# EasyEDA Pro project FC_GC_PCB.eprj

# Schematic Schematic6
Create Date: 2024-12-30; Page Name: P1; Project Name: Quadrotor_Mk2; Schematic Name: Schematic6; Update Date: 2025-01-03; Company: EasyEDA.com; Drawn: EasyEDA; Page Size: A4; Part Number: JLCPCB-002; Reviewed: EasyEDA; Version: V0.1
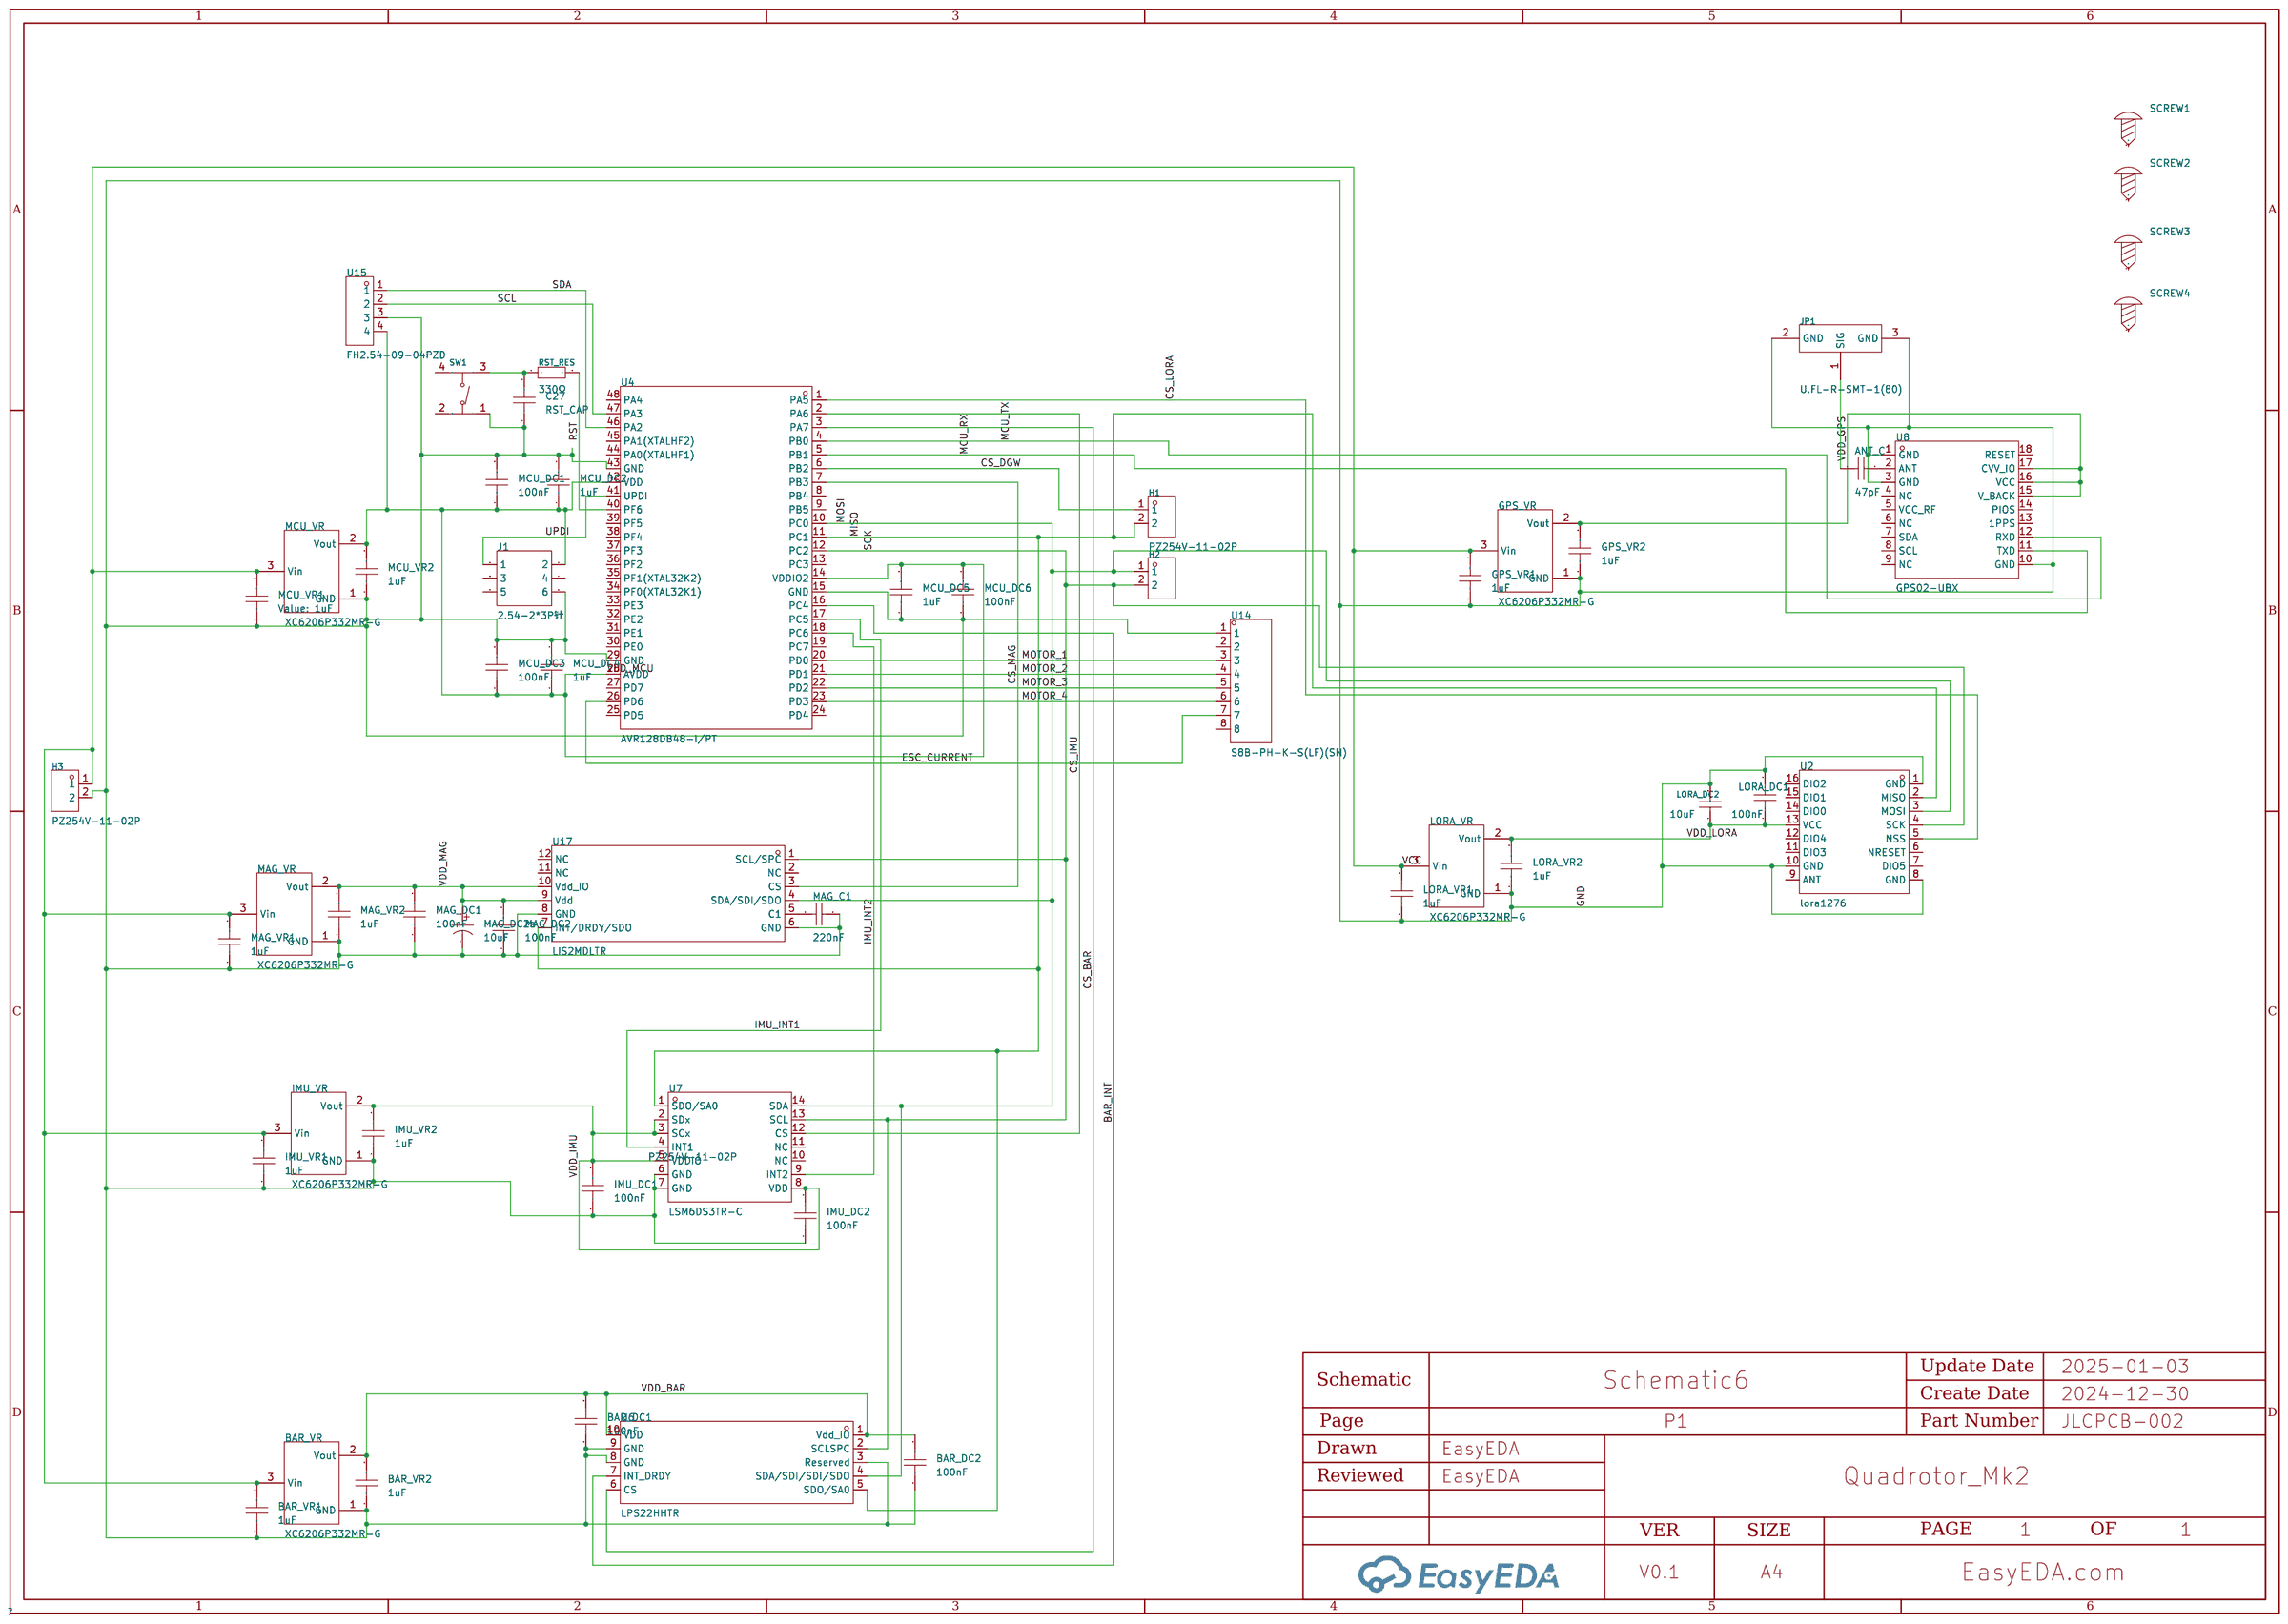
[diagram p0: schematic sheet]

## Parts
ANT_C  47pF  [C0402]
BAR_DC1  100nF  [C0402]
BAR_DC2  100nF  [C0402]
BAR_VR  XC6206P332MR-G  [SOT-23-3_L2.9-W1.6-P1.90-LS2.8-BR]
BAR_VR1  1uF  [C0402]
BAR_VR2  1uF  [C0402]
C27  1uF  [C0603]
GPS_VR  XC6206P332MR-G  [SOT-23-3_L2.9-W1.6-P1.90-LS2.8-BR]
GPS_VR1  1uF  [C0402]
GPS_VR2  1uF  [C0402]
H1  PZ254V-11-02P  [HDR-TH_2P-P2.54-V-M]
H2  PZ254V-11-02P  [HDR-TH_2P-P2.54-V-M]
H3  PZ254V-11-02P  [HDR-TH_2P-P2.54-V-M]
IMU_DC1  100nF  [C0402]
IMU_DC2  100nF  [C0402]
IMU_VR  XC6206P332MR-G  [SOT-23-3_L2.9-W1.6-P1.90-LS2.8-BR]
IMU_VR1  1uF  [C0402]
IMU_VR2  1uF  [C0402]
J1  2.54-2*3P针  [HDR-TH_6P-P2.54-V-M-R2-C3-S2.54-1]
JP1  U.FL-R-SMT-1(80)  [RF-SMD_FRF05002-JSS103M]
LORA_DC1  100nF  [C0402]
LORA_DC2  10uF  [C0402]
LORA_VR  XC6206P332MR-G  [SOT-23-3_L2.9-W1.6-P1.90-LS2.8-BR]
LORA_VR1  1uF  [C0402]
LORA_VR2  1uF  [C0402]
MAG_C1  220nF  [C0402]
MAG_DC1  100nF  [C0402]
MAG_DC2  100nF  [C0402]
MAG_DC2a  10uF  [CAP-SMD_BD6.3-L6.6-W6.6-FD]
MAG_VR  XC6206P332MR-G  [SOT-23-3_L2.9-W1.6-P1.90-LS2.8-BR]
MAG_VR1  1uF  [C0402]
MAG_VR2  1uF  [C0402]
MCU_DC1  100nF  [C0402]
MCU_DC2  1uF  [C0402]
MCU_DC3  100nF  [C0402]
MCU_DC4  1uF  [C0402]
MCU_DC5  1uF  [C0402]
MCU_DC6  100nF  [C0402]
MCU_VR  XC6206P332MR-G  [SOT-23-3_L2.9-W1.6-P1.90-LS2.8-BR]
MCU_VR1  1uF  [C0402]
MCU_VR2  1uF  [C0402]
RST_RES  330Ω  [R0402]
SCREW1  -  [Screw-Hole-M2]
SCREW2  -  [Screw-Hole-M2]
SCREW3  -  [Screw-Hole-M2]
SCREW4  -  [Screw-Hole-M2]
SW1  TS-1187A-B-A-B  [SW-SMD_4P-L5.1-W5.1-P3.70-LS6.5-TL-2]
U2  lora1276  [COMM-SMD_LORA1276-C1-915MHZ]
U4  AVR128DB48-I/PT  [TQFP-48_L7.0-W7.0-P0.50-LS9.0-BL]
U6  LPS22HHTR  [HLGA-10L_LPS22HBTR]
U7  LSM6DS3TR-C  [LGA-14_L3.0-W2.5-P0.50-TL]
U8  GPS02-UBX  [WIRELM-SMD_18P-L16.5-W14.5_P1.80-TL]
U14  S8B-PH-K-S(LF)(SN)  [CONN-TH_S8B-PH-K-S-LF-SN]
U15  FH2.54-09-04PZD  [HDR-TH_4P-P2.54-V-F]
U17  LIS2MDLTR  [LGA-12_L2.0-W2.0-P0.50-BL]

## Library data of the parts
ANT_C = 0402CG470J500NT: Capacitance: Tolerance:±5% Tolerance:±5% Voltage Rated: Temperature Coefficient:; LCSC Part Name: 47pF ±5% 50V; Supplier Part: C1567; Manufacturer: FH(风华); Supplier Footprint: 0402; JLCPCB Part Class: Basic Part; Datasheet: https://atta.szlcsc.com/upload/public/pdf/source/20200305/C486355_26A10D38EF8C2A5C37091D0039909270.pdf; Supplier: LCSC; Tolerance: ±5%
BAR_DC1 BAR_DC2 IMU_DC1 IMU_DC2 LORA_DC1 MAG_DC1 MAG_DC2 MCU_DC1 MCU_DC3 MCU_DC6 = CL05B104KO5NNNC: Capacitance: Tolerance:±10% Tolerance:±10% Voltage Rated: Temperature Coefficient:; LCSC Part Name: 100nF ±10% 16V; Supplier Part: C1525; Manufacturer: SAMSUNG(三星); Supplier Footprint: 0402; JLCPCB Part Class: Basic Part; Datasheet: https://atta.szlcsc.com/upload/public/pdf/source/20160218/1457707763339.pdf; Supplier: LCSC; Tolerance: ±10%
BAR_VR GPS_VR IMU_VR LORA_VR MAG_VR MCU_VR = XC6206P332MR-G_C5446: Output Type: Maximum Input Voltage:6V Output Voltage:3.3V Output Voltage:3.3V MAX Output Current:200mA Power Supply Rejection Ratio (PSRR):- Dropout Voltage:680mV@(100mA) Output Polarity:Positive electrode Number of Outputs:1; LCSC Part Name: 输入6V 输出3.3V 200mA; Supplier Part: C5446; Manufacturer: TOREX(特瑞仕); Supplier Footprint: SOT-23-3L; JLCPCB Part Class: Basic Part; Datasheet: https://atta.szlcsc.com/upload/public/pdf/source/20130823/1457706639850.pdf; Supplier: LCSC; Maximum Input Voltage: 6V; Output Voltage: 3.3V; MAX Output Current: 200mA; Dropout Voltage: 680mV@(100mA); Output Polarity: Positive electrode; Number of Outputs: 1
BAR_VR1 BAR_VR2 GPS_VR1 GPS_VR2 IMU_VR1 IMU_VR2 LORA_VR1 LORA_VR2 MAG_VR1 MAG_VR2 MCU_DC2 MCU_DC4 MCU_DC5 MCU_VR1 MCU_VR2 = CL05A105KA5NQNC: Capacitance: Tolerance:±10% Tolerance:±10% Voltage Rated: Temperature Coefficient:; LCSC Part Name: 1uF ±10% 25V; Supplier Part: C52923; Manufacturer: SAMSUNG(三星); Supplier Footprint: 0402; JLCPCB Part Class: Basic Part; Datasheet: https://atta.szlcsc.com/upload/public/pdf/source/20160218/1457707763339.pdf; Supplier: LCSC; Tolerance: ±10%
C27 = CL10A105KB8NNNC: Capacitance: Tolerance:±10% Tolerance:±10% Voltage Rated: Temperature Coefficient:; LCSC Part Name: 1uF ±10% 50V; Supplier Part: C15849; Manufacturer: SAMSUNG(三星); Supplier Footprint: 0603; JLCPCB Part Class: Basic Part; Datasheet: https://atta.szlcsc.com/upload/public/pdf/source/20160218/1457707763339.pdf; Supplier: LCSC; Tolerance: ±10%
H1-H3 = PZ254V-11-02P: Pin Structure:1x2P Pitch:2.54mm Row Spacing:- Circluar Pins/Square Pins:Square Pins Mounting Type:Straight Number of Rows:Plugin Number of Pins:2P Current Rating (Max):- Voltage Rating (Max):- Length of Mating Pin:6mm Insulation Height:2.5mm Length of End; LCSC Part Name: 间距:2.54mm 1x2P 直插 方针; Supplier Part: C492401; Manufacturer: XFCN(兴飞); Supplier Footprint: 插件,P=2.54mm; JLCPCB Part Class: Extended Part; Datasheet: https://atta.szlcsc.com/upload/public/pdf/source/20200309/C492401_A812433581A9B211A7FFA413ADDFF0E5.pdf; Supplier: LCSC; Pin Structure: 1x2P; Pitch: 2.54mm; Circluar Pins/Square Pins: Square Pins; Mounting Type: Straight; Number of Rows: Plugin; Number of Pins: 2P; Length of Mating Pin: 6mm; Insulation Height: 2.5mm; Length of End Connection Pin: 3mm; Operating Temperature Range: -40℃~+105℃; Color: Black
J1 = 2.54-2*3P针: Pin Structure:- Pitch:2.54mm Row Spacing:- Circluar Pins/Square Pins:- Mounting Type:Straight Number of Rows:双排 Number of Pins:6P Current Rating (Max):- Voltage Rating (Max):- Length of Mating Pin:- Insulation Height:- Contact Material: Contact Plating:-; LCSC Part Name: 间距:2.54mm 直插; Supplier Part: C65114; Manufacturer: BOOMELE(博穆精密); Supplier Footprint: 插件,P=2.54mm; JLCPCB Part Class: Extended Part; Supplier: LCSC; Pitch: 2.54mm; Mounting Type: Straight; Number of Rows: 双排; Number of Pins: 6P; Color: Black
JP1 = U.FL-R-SMT-1(80)_C88374: Connector Type:板端 Interface Type:内针 Number of Ports:1 Interface Diameter:2mm Interface Length/Height:1.25mm Frequency-Max:6GHz RF Series:IPEX Impedance:50Ω Style:- Contact Material:Brass Operating Temperature Range:-40℃~+90℃ Operating Temperature Range:-4; LCSC Part Name: IPEX 内针; Supplier Part: C88374; Manufacturer: HRS(广濑); Supplier Footprint: SMD; JLCPCB Part Class: Extended Part; Datasheet: https://atta.szlcsc.com/upload/public/pdf/source/20161125/1480067868647.pdf; Supplier: LCSC; Connector Type: 板端; Interface Type: 内针; Number of Ports: 1; Interface Diameter: 2mm; Interface Length/Height: 1.25mm; Frequency-Max: 6GHz; RF Series: IPEX; Impedance: 50Ω; Contact Material: Brass; Operating Temperature Range: -40℃~+90℃
LORA_DC2 = CL05A106MQ5NUNC: Capacitance: Tolerance:±20% Tolerance:±20% Voltage Rated: Temperature Coefficient:; LCSC Part Name: 10uF ±20% 6.3V; Supplier Part: C15525; Manufacturer: SAMSUNG(三星); Supplier Footprint: 0402; JLCPCB Part Class: Basic Part; Datasheet: https://atta.szlcsc.com/upload/public/pdf/source/20220823/2B02EE04F8F211D38A52DCB16EB6BEBA.pdf; Supplier: LCSC; Tolerance: ±20%
MAG_C1 = CL05B224KO5NNNC: Capacitance: Tolerance:±10% Tolerance:±10% Voltage Rated: Temperature Coefficient:; LCSC Part Name: 220nF ±10% 16V; Supplier Part: C16772; Manufacturer: SAMSUNG(三星); Supplier Footprint: 0402; JLCPCB Part Class: Basic Part; Datasheet: https://atta.szlcsc.com/upload/public/pdf/source/20160218/1457707763339.pdf; Supplier: LCSC; Tolerance: ±10%
MAG_DC2a = RVT1J100M0605_C72489: Capacitance: Tolerance:±20% Tolerance:±20% Rated Voltage: Ripple Current:15mA@120Hz Equivalent Series Resistance(ESR):- φD: L: Lifetime @ Temp:2000hrs@105℃ Operating Temperature:-40℃~+105℃ Operating Temperature:-40℃~+105℃; LCSC Part Name: 10uF ±20% 63V; Supplier Part: C72489; Manufacturer: ROQANG(容强); Manufacturer Part: RVT1J100M0605; Supplier Footprint: SMD,D6.3xL5.4mm; JLCPCB Part Class: Extended Part; Datasheet: https://atta.szlcsc.com/upload/public/pdf/source/20170325/1490427950282.pdf; Supplier: LCSC; Tolerance: ±20%; Ripple Current: 15mA@120Hz; Lifetime @ Temp: 2000hrs@105℃; Operating Temperature: -40℃~+105℃
RST_RES = 0402WGF3300TCE: Type:Thick Film Resistors Resistance: Tolerance:±1% Tolerance:±1% Power(Watts): Overload Voltage (Max): Temperature Coefficient:±100ppm/℃ Temperature Coefficient:±100ppm/℃ Operating Temperature Range:-55℃~+155℃ Operating Temperature Range:-55℃~+155℃; LCSC Part Name: 330Ω ±1% 62.5mW 厚膜电阻; Supplier Part: C25104; Manufacturer: UNI-ROYAL(厚声); Supplier Footprint: 0402; JLCPCB Part Class: Basic Part; Datasheet: https://atta.szlcsc.com/upload/public/pdf/source/20200306/C422600_1E6D84923E4A46A82E41ADD87F860B5C.pdf; Supplier: LCSC; Type: Thick Film Resistors; Tolerance: ±1%; Temperature Coefficient: ±100ppm/℃; Operating Temperature Range: -55℃~+155℃
SCREW1-SCREW4 = Screw-Hole-M2: Supplier Footprint: 插件
SW1 = TS-1187A-B-A-B: Circuit:SPST Actuator Style:Round Button Operating Force:160gf Mounting Style:Brick nogging Switch Length:5.1mm Switch Width:5.1mm Switch Height:1.5mm Strike Gundam:不带 Contact Current:50mA Voltage Rating (DC):12V Insulation Resistance:- Actuator/Cap Color; LCSC Part Name: 5.1*5.1*1.5mm 立贴 轻触开关; Supplier Part: C318884; Manufacturer: XKB Connectivity(中国星坤); Supplier Footprint: SMD; JLCPCB Part Class: Basic Part; Datasheet: https://atta.szlcsc.com/upload/public/pdf/source/20200227/C318890_053E50208A88A7BA1965D8746000774E.pdf; Supplier: LCSC; Circuit: SPST; Actuator Style: Round Button; Operating Force: 160gf; Mounting Style: Brick nogging; Switch Length: 5.1mm; Switch Width: 5.1mm; Switch Height: 1.5mm; Strike Gundam: 不带; Contact Current: 50mA; Voltage Rating (DC): 12V; Actuator/Cap Color: 金色; With Lamp: No; Mechanical Life: 10万次; Operating Temperature: -30℃~+85℃
U2 = lora1276-C1-915MHz: Frequency:915MHz; LCSC Part Name: 915MHz无线模块; Supplier Part: C3001531; Manufacturer: G-NiceRF(思为无线); Supplier Footprint: SMD,16x16mm; JLCPCB Part Class: Extended Part; Datasheet: https://atta.szlcsc.com/upload/public/pdf/source/20220425/530C73F5612432B98CDC262676D34B0B.pdf; Supplier: LCSC
U4 = AVR128DB48-I/PT: CPU Core:AVR Program Storage Size:128KB GPIO Ports Number:41 Operating Voltage Range:1.8V~5.5V Operating Voltage Range:1.8V~5.5V CPU Maximum Speed:24MHz Program Memory Type:FLASH Operating Temperature Range:-40℃~+85℃ Operating Temperature Range:-40℃~+85℃; Supplier Part: C1019766; Manufacturer: MICROCHIP(美国微芯); Supplier Footprint: TQFP-48(7x7); JLCPCB Part Class: Extended Part; Datasheet: https://atta.szlcsc.com/upload/public/pdf/source/20220119/C1518646_E8BAF3779FDA96BF0868C8C588FF4BEB.pdf; Supplier: LCSC; CPU Core: AVR; Program Storage Size: 128KB; GPIO Ports Number: 41; Operating Voltage Range: 1.8V~5.5V; CPU Maximum Speed: 24MHz; Program Memory Type: FLASH; Operating Temperature Range: -40℃~+85℃; ADC (Bit): 12bit; DAC (Bit): 10bit; Peripheral/Function: WDT；PWM; Watchdog: 有; Low-Voltage Detect: 有; Internal Oscillator: 有
U6 = LPS22HHTR: Pressure range:26Kpa~126Kpa Pressure range:26Kpa~126Kpa The Power Supply Voltage:1.7V~3.6V The Power Supply Voltage:1.7V~3.6V Operating Temperature:-40℃~+85℃ Operating Temperature:-40℃~+85℃; Supplier Part: C2827824; Manufacturer: ST(意法半导体); Supplier Footprint: HLGA-10(2x2); JLCPCB Part Class: Extended Part; Datasheet: https://atta.szlcsc.com/upload/public/pdf/source/20210707/C2827824_E4CD2E1AEEC461DC537A3A43C6466376.pdf; Supplier: LCSC; Pressure range: 26Kpa~126Kpa; The Power Supply Voltage: 1.7V~3.6V; Operating Temperature: -40℃~+85℃
U7 = LSM6DS3TR-C: Sensor Type:Accelerometer gyroscope Operating Temperature:-40℃~+85℃ Operating Temperature:-40℃~+85℃; LCSC Part Name: IMU-惯性测量单元; Supplier Part: C967633; Manufacturer: ST(意法半导体); Supplier Footprint: LGA-14(2.5x3); JLCPCB Part Class: Extended Part; Datasheet: https://atta.szlcsc.com/upload/public/pdf/source/20210226/C967633_4D8B3A108D63359423D57B97CE5134B1.pdf; Supplier: LCSC; Sensor Type: Accelerometer gyroscope; Operating Temperature: -40℃~+85℃
U8 = GPS02-UBX: LCSC Part Name: 全球导航卫星系统GNSS定位模块; Supplier Part: C5356636; Manufacturer: G-NiceRF(思为无线); Supplier Footprint: SMD,14.5x16.5mm; JLCPCB Part Class: Extended Part; Datasheet: https://atta.szlcsc.com/upload/public/pdf/source/20240219/98FC715792FCB9DB389B319052DA0820.pdf; Supplier: LCSC
U14 = S8B-PH-K-S(LF)(SN): Pins Structure:1x8P Pitch:2mm Mounting Style:Bend insert Reference Series:PH Number of Pins:8P Number of Rows:1 Number of PINs Per Row:8 Row Spacing:- Current Rating (Max):2A Contact Material:Brass Contact Plating:Tin Operating Temperature Range:-25℃~+85℃; LCSC Part Name: 1x8P 间距:2mm 弯插 系列:PH; Supplier Part: C157915; Manufacturer: JST; Supplier Footprint: 弯插,P=2mm; JLCPCB Part Class: Extended Part; Datasheet: https://atta.szlcsc.com/upload/public/pdf/source/20181010/C265101_22107ACC4D8714694FDA2DD97145FA81.pdf; Supplier: LCSC; Pins Structure: 1x8P; Pitch: 2mm; Mounting Style: Bend insert; Reference Series: PH; Number of Pins: 8P; Number of Rows: 1; Number of PINs Per Row: 8; Current Rating (Max): 2A; Contact Material: Brass; Contact Plating: Tin; Operating Temperature Range: -25℃~+85℃; Rated Voltage (Max): 100V; Plastic Material: PA66; Flame Retardant Rating: UL94V-0; Supplementary Features: K-leg punch; Colour: White; Z-Height of the Board: 4.8mm; X-Length of Bottom Edge on Board (Spacing Line): 17.9mm; Y-Width of Bottom Edge on Board: 7.6mm
U15 = FH2.54-09-04PZD: Supplier Part: C7500773; Manufacturer: XUNPU(讯普); Supplier Footprint: 插件,P=2.54mm; JLCPCB Part Class: Extended Part; Datasheet: https://atta.szlcsc.com/upload/public/pdf/source/20230809/12C46BEDB70740F4680EB1129D481D12.pdf; Supplier: LCSC
U17 = LIS2MDLTR: LCSC Part Name: 霍尔效应开关; Supplier Part: C919695; Manufacturer: ST(意法半导体); Supplier Footprint: LGA-12(2x2); JLCPCB Part Class: Extended Part; Datasheet: https://atta.szlcsc.com/upload/public/pdf/source/20211119/145E3A73C2A09E2C981D93C27CF540FA.pdf; Supplier: LCSC

## Nets
GND: BAR_DC1.1 BAR_DC2.1 BAR_VR.1(GND) BAR_VR1.1 BAR_VR2.1 C27.1 GPS_VR.1(GND) GPS_VR1.1 GPS_VR2.1 H3.2 IMU_DC1.1 IMU_DC2.1 IMU_VR.1(GND) IMU_VR1.1 IMU_VR2.1 J1.6 JP1.2(GND) JP1.3(GND) LORA_DC1.2 LORA_DC2.2 LORA_VR.1(GND) LORA_VR1.1 LORA_VR2.1 MAG_C1.2 MAG_DC1.1 MAG_DC2.1 MAG_DC2a.2 MAG_VR.1(GND) MAG_VR1.1 MAG_VR2.1 MCU_DC1.2 MCU_DC2.2 MCU_DC3.2 MCU_DC4.2 MCU_DC5.1 MCU_DC6.1 MCU_VR.1(GND) MCU_VR1.1 MCU_VR2.1 SW1.1(A) U2.1(GND) U2.8(GND) U2.10(GND) U4.15(GND) U4.29(GND) U4.43(GND) U6.3(Reserved) U6.8(GND) U6.9(GND) U7.6(GND) U7.7(GND) U8.1(GND) U8.3(GND) U8.10(GND) U14.1 U15.3 U17.6(GND) U17.8(GND)
VCC: BAR_VR.3(Vin) BAR_VR1.2 GPS_VR.3(Vin) GPS_VR1.2 H3.1 IMU_VR.3(Vin) IMU_VR1.2 LORA_VR.3(Vin) LORA_VR1.2 MAG_VR.3(Vin) MAG_VR1.2 MCU_VR.3(Vin) MCU_VR1.2
VDD_BAR: BAR_DC1.2 BAR_DC2.2 BAR_VR.2(Vout) BAR_VR2.2 U6.1(Vdd_IO) U6.10(VDD)
VDD_GPS: GPS_VR.2(Vout) GPS_VR2.2 U8.15(V_BACK) U8.16(VCC) U8.17(CVV_IO)
VDD_IMU: IMU_DC1.2 IMU_DC2.2 IMU_VR.2(Vout) IMU_VR2.2 U7.2(SDx) U7.3(SCx) U7.5(VDDIO) U7.8(VDD)
VDD_LORA: LORA_DC1.1 LORA_DC2.1 LORA_VR.2(Vout) LORA_VR2.2 U2.13(VCC)
VDD_MAG: MAG_DC1.2 MAG_DC2.2 MAG_DC2a.1 MAG_VR.2(Vout) MAG_VR2.2 U17.9(Vdd) U17.10(Vdd_IO)
VDD_MCU: J1.2 MCU_DC1.1 MCU_DC2.1 MCU_DC3.1 MCU_DC4.1 MCU_DC5.2 MCU_DC6.2 MCU_VR.2(Vout) MCU_VR2.2 U4.14(VDDIO2) U4.28(AVDD) U4.42(VDD) U15.4
BAR_INT: U4.16(PC4) U6.7(INT_DRDY)
CS_BAR: U4.3(PA7) U6.6(CS)
CS_DGW: H1.1 U4.6(PB2)
CS_IMU: U4.2(PA6) U7.12(CS)
CS_LORA: U2.5(NSS) U4.1(PA5)
CS_MAG: U4.7(PB3) U17.3(CS)
ESC_CURRENT: U4.26(PD6) U14.7
IMU_INT1: U4.17(PC5) U7.4(INT1)
IMU_INT2: U4.18(PC6) U7.9(INT2)
MCU_RX: U4.5(PB1) U8.11(TXD)
MCU_TX: U4.4(PB0) U8.12(RXD)
MISO: H1.2 U2.2(MISO) U4.11(PC1) U6.5(SDO/SA0) U7.1(SDO/SA0) U17.7(INT/DRDY/SDO)
MOSI: H2.1 U2.3(MOSI) U4.10(PC0) U6.4(SDA/SDI/SDI/SDO) U7.14(SDA) U17.4(SDA/SDI/SDO)
MOTOR_1: U4.20(PD0) U14.3
MOTOR_2: U4.21(PD1) U14.4
MOTOR_3: U4.22(PD2) U14.5
MOTOR_4: U4.23(PD3) U14.6
RST: RST_RES.2 U4.40(PF6)
SCK: H2.2 U2.4(SCK) U4.12(PC2) U6.2(SCLSPC) U7.13(SCL) U17.1(SCL/SPC)
SCL: U4.47(PA3) U15.2
SDA: U4.46(PA2) U15.1
UPDI: J1.1 U4.41(UPDI)
$1N5000: C27.2 RST_RES.1 SW1.3(C)
$1N10503: MAG_C1.1 U17.5(C1)
$1N13814: ANT_C.2 U8.2(ANT)
$1N16458: ANT_C.1 JP1.1(SIG)

Not connected (* = marked no-connect by the designer): J1 3 4 5; SCREW1 1; SCREW2 1; SCREW3 1; SCREW4 1; SW1 2(B) 4(D); U2 6(NRESET) 7(DIO5) 9(ANT) 11(DIO3) 12(DIO4) 14(DIO0) 15(DIO1) 16(DIO2); U4 8(PB4) 9(PB5) 13(PC3) 19(PC7) 24(PD4) 25(PD5) 27(PD7) 30(PE0) 31(PE1) 32(PE2) 33(PE3) 34(PF0(XTAL32K1)) 35(PF1(XTAL32K2)) 36(PF2) 37(PF3) 38(PF4) 39(PF5) 44(PA0(XTALHF1)) 45(PA1(XTALHF2)) 48(PA4); U7 10(NC) 11(NC); U8 4(NC) 5(VCC_RF) 6(NC) 7(SDA) 8(SCL) 9(NC) 13(1PPS) 14(PIOS) 18(RESET); U14 2 8; U17 2(NC) 11(NC) 12(NC)

# Board PCB9
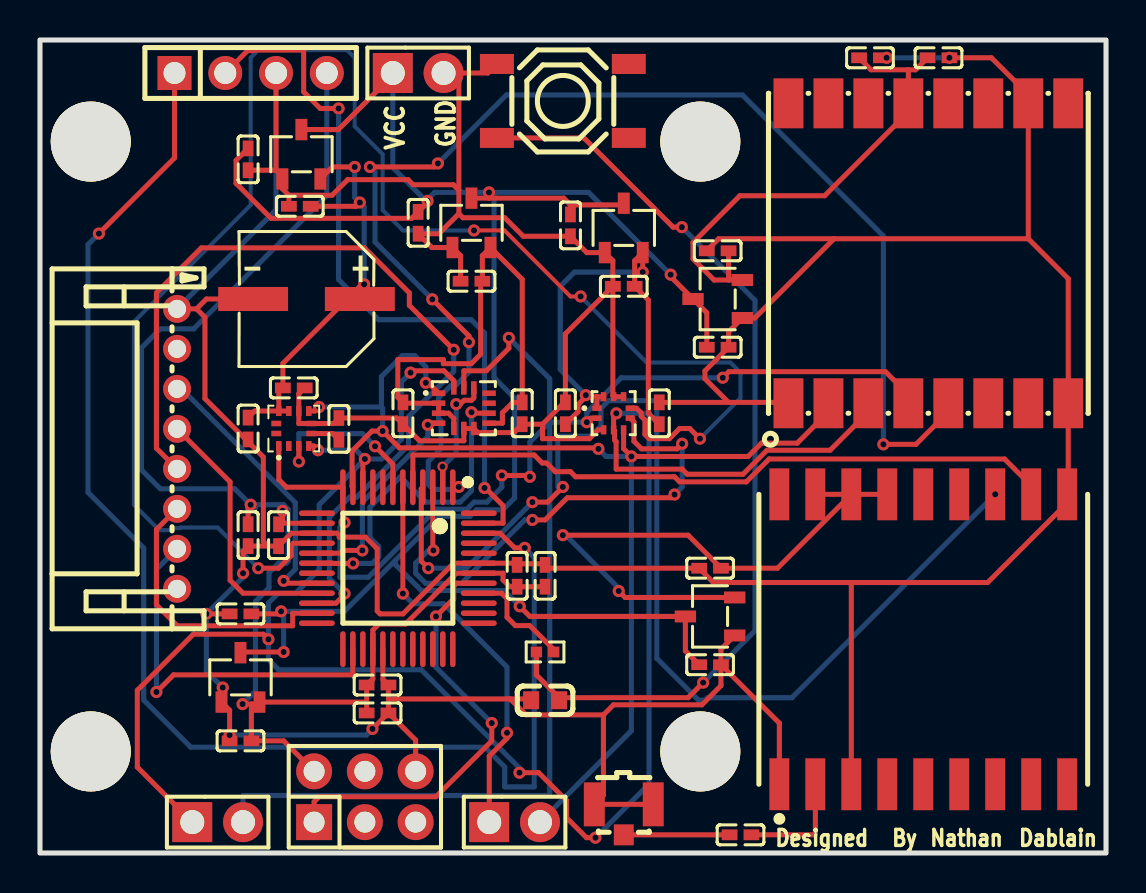
[diagram p1: board, top side]
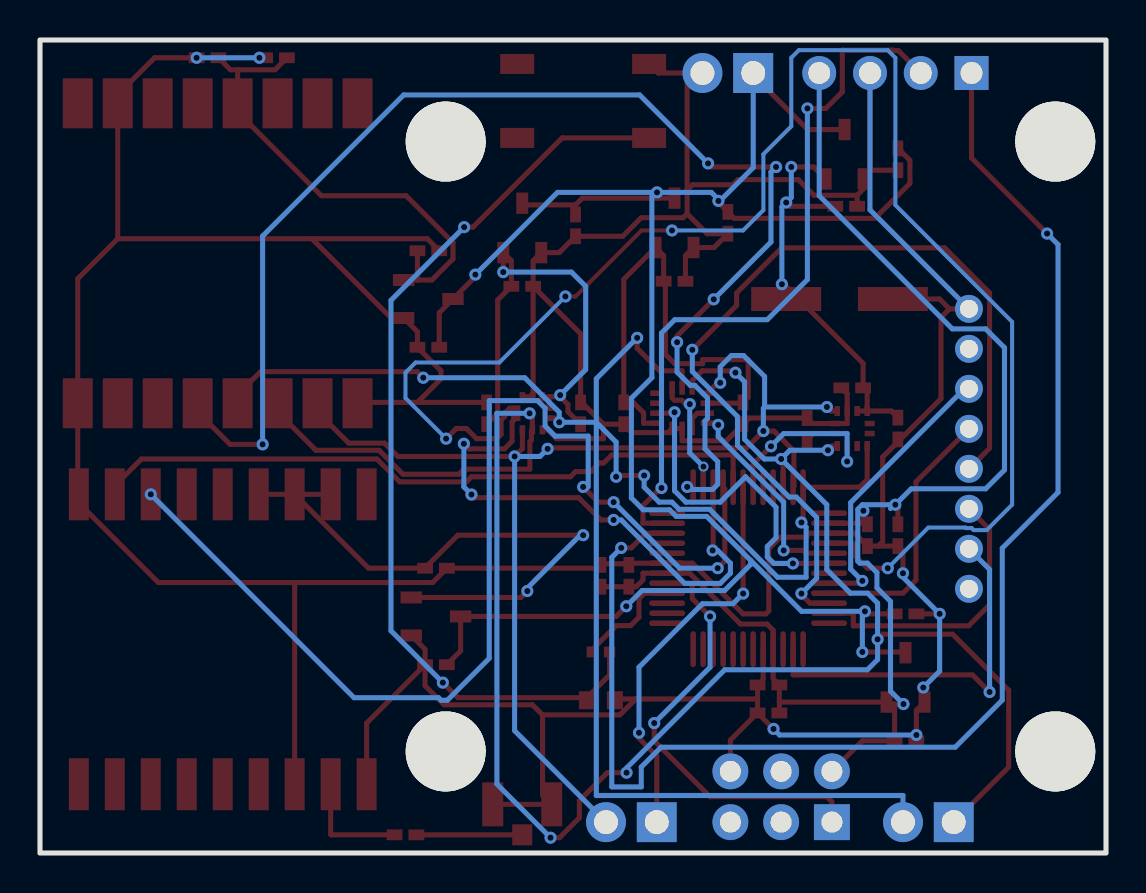
[diagram p2: board, bottom side, seen from below]

Outline 53.34 x 40.66 mm; copper layers: Top Layer, Bottom Layer. Coordinates in mm from the lower left corner of the outline.
Outline path: rectangle 0,40.66 53.34,0
Stack: Top Layer 0.035mm / Dielectric1 1.51mm FR4 er 4.5 / Bottom Layer 0.035mm

## Design rules (mm)
template: JLCPCB Capability(Two Layers Board)
spacing copperThickness1oz (default): track to track 0.102, other pairs 0.152 to 0.3
spacing copperThickness2oz: track to track 0.203, other pairs 0.152 to 0.3
track width copperThickness1oz (default): min 0.127, default 0.254, max 2.54
track width copperThickness2oz: min 0.203, default 0.254, max 2.54
differential pair differentialPair (default): width min 0.127, default 0.254, max 2.54; gap min 0.152, default 0.152
via viaSize (default): diameter min 0.5, default 0.61, max 10; hole min 0.3, default 0.305, max 6.3

## Placement (name value [footprint] x y rotation side)
ANT_C  47pF  [C0402]  35.05 0.91 0 top
BAR_DC1  100nF  [C0402]  30.99 21.99 270 top
BAR_DC2  100nF  [C0402]  26.29 21.99 270 top
BAR_VR  XC6206P332MR-G  [SOT-23-3_L2.9-W1.6-P1.90-LS2.8-BR]  29.21 31.26 270 top
BAR_VR1  1uF  [C0402]  26.54 31.39 90 top
BAR_VR2  1uF  [C0402]  29.21 28.34 0 top
C27  1uF  [C0603]  25.27 7.64 0 top
GPS_VR  XC6206P332MR-G  [SOT-23-3_L2.9-W1.6-P1.90-LS2.8-BR]  33.53 11.83 0 top
GPS_VR1  1uF  [C0402]  33.53 9.42 180 top
GPS_VR2  1uF  [C0402]  33.53 14.24 0 top
H1  PZ254V-11-02P  [HDR-TH_2P-P2.54-V-M]  23.75 1.54 0 top
H2  PZ254V-11-02P  [HDR-TH_2P-P2.54-V-M]  8.89 1.54 0 top
H3  PZ254V-11-02P  [HDR-TH_2P-P2.54-V-M]  18.92 39.01 0 top
IMU_DC1  100nF  [C0402]  24.13 21.99 90 top
IMU_DC2  100nF  [C0402]  18.16 21.99 90 top
IMU_VR  XC6206P332MR-G  [SOT-23-3_L2.9-W1.6-P1.90-LS2.8-BR]  21.59 31.52 270 top
IMU_VR1  1uF  [C0402]  18.92 31.52 90 top
IMU_VR2  1uF  [C0402]  21.59 28.6 0 top
J1  2.54-2*3P针  [HDR-TH_6P-P2.54-V-M-R2-C3-S2.54-1]  16.26 2.81 0 top
JP1  U.FL-R-SMT-1(80)  [RF-SMD_FRF05002-JSS103M]  29.21 1.67 0 top
LORA_DC1  100nF  [C0402]  44.96 39.77 0 top
LORA_DC2  10uF  [C0402]  41.53 39.77 0 top
LORA_VR  XC6206P332MR-G  [SOT-23-3_L2.9-W1.6-P1.90-LS2.8-BR]  33.91 27.71 0 top
LORA_VR1  1uF  [C0402]  33.91 25.29 180 top
LORA_VR2  1uF  [C0402]  33.91 30.12 0 top
MAG_C1  220nF  [C0402]  14.96 21.21 90 top
MAG_DC1  100nF  [C0402]  10.41 21.23 90 top
MAG_DC2  100nF  [C0402]  12.7 23.26 180 top
MAG_DC2a  10uF  [CAP-SMD_BD6.3-L6.6-W6.6-FD]  13.33 27.71 180 top
MAG_VR  XC6206P332MR-G  [SOT-23-3_L2.9-W1.6-P1.90-LS2.8-BR]  13.08 34.95 270 top
MAG_VR1  1uF  [C0402]  10.41 34.69 90 top
MAG_VR2  1uF  [C0402]  13 32.34 0 top
MCU_DC1  100nF  [C0402]  25.27 13.86 90 top
MCU_DC2  1uF  [C0402]  23.88 13.86 90 top
MCU_DC3  100nF  [C0402]  10.41 15.9 270 top
MCU_DC4  1uF  [C0402]  11.94 15.9 270 top
MCU_DC5  1uF  [C0402]  16.89 8.4 180 top
MCU_DC6  100nF  [C0402]  16.89 7.01 180 top
MCU_VR  XC6206P332MR-G  [SOT-23-3_L2.9-W1.6-P1.90-LS2.8-BR]  10.03 8.78 270 top
MCU_VR1  1uF  [C0402]  10.03 11.96 0 top
MCU_VR2  1uF  [C0402]  10.03 5.61 0 top
RST_RES  330Ω  [R0402]  25.27 10.05 0 top
SCREW1  -  [screw-hole-m2]  2.54 35.58 0 top
SCREW2  -  [screw-hole-m2]  2.54 5.08 0 top
SCREW3  -  [screw-hole-m2]  33.04 35.58 0 top
SCREW4  -  [screw-hole-m2]  33.04 5.08 0 top
SW1  TS-1187A-B-A-B  [SW-SMD_4P-L5.1-W5.1-P3.70-LS6.5-TL-2]  26.16 37.61 0 top
U2  lora1276  [COMM-SMD_LORA1276-C1-915MHZ]  44.45 29.99 90 top
U4  AVR128DB48-I/PT  [TQFP-48_L7.0-W7.0-P0.50-LS9.0-BL]  17.91 14.24 180 top
U6  LPS22HHTR  [HLGA-10L_LPS22HBTR]  28.7 21.99 0 top
U7  LSM6DS3TR-C  [LGA-14_L3.0-W2.5-P0.50-TL]  21.21 22.25 0 top
U8  GPS02-UBX  [WIRELM-SMD_18P-L16.5-W14.5_P1.80-TL]  44.2 10.69 90 top
U14  S8B-PH-K-S(LF)(SN)  [CONN-TH_S8B-PH-K-S-LF-SN]  6.86 20.21 90 top
U15  FH2.54-09-04PZD  [HDR-TH_4P-P2.54-V-F]  10.54 39.01 0 top
U17  LIS2MDLTR  [LGA-12_L2.0-W2.0-P0.50-BL]  12.7 21.23 0 top

## Footprints (pads in the part's own frame, mm; a bottom-side part is the same pattern mirrored in y, then rotated)
C0402
  rect 0.79x0.54 smd: 1(-0.545,0) 2(0.545,0)
C0603
  rect 0.8x0.9 smd: 1(-0.7,0) 2(0.7,0)
CAP-SMD_BD6.3-L6.6-W6.6-FD
  rect 3.5x1.2 smd: 1(-2.67,0) 2(2.67,0)
COMM-SMD_LORA1276-C1-915MHZ
  rect 2.5x1.5 smd: 1(-7.5,7) 2(-7.5,5) 3(-7.5,3) 4(-7.5,1) 5(-7.5,-1) 6(-7.5,-3) 7(-7.5,-5) 8(-7.5,-7) 9(7.5,-7) 10(7.5,-5) 11(7.5,-3) 12(7.5,-1) 13(7.5,1) 14(7.5,3) 15(7.5,5) 16(7.5,7)
CONN-TH_S8B-PH-K-S-LF-SN
  round 1.4 hole 0.9: 1(7,0) 2(5,0) 3(3,0) 4(1,0) 5(-1,0) 6(-3,0) 7(-5,0) 8(-7,0)
HDR-TH_2P-P2.54-V-M
  rect 2x2 hole 1.2: 1(-1.27,0)
  round 2 hole 1.2: 2(1.27,0)
HDR-TH_4P-P2.54-V-F
  rect 1.7x1.7 hole 1.1: 1(-3.81,0)
  round 1.7 hole 1.1: 2(-1.27,0) 3(1.27,0) 4(3.81,0)
HDR-TH_6P-P2.54-V-M-R2-C3-S2.54-1
  rect 1.8x1.8 hole 1.05: 1(-2.54,-1.27)
  round 1.8 hole 1.05: 2(-2.54,1.27) 3(0,-1.27) 4(0,1.27) 5(2.54,-1.27) 6(2.54,1.27)
HLGA-10L_LPS22HBTR
  rect 0.465x0.28 smd: 1(-0.833,0.255) 2(-0.833,-0.245) 6(0.833,-0.245) 7(0.833,0.255)
  rect 0.28x0.465 smd: 3(-0.5,-0.828) 4(0,-0.828) 5(0.5,-0.828) 8(0.5,0.828) 9(0,0.828) 10(-0.5,0.828)
LGA-12_L2.0-W2.0-P0.50-BL
  rect 0.28x0.5 smd: 1(-0.75,-0.875) 2(-0.25,-0.875) 3(0.25,-0.875) 4(0.75,-0.875) 7(0.75,0.875) 8(0.25,0.875) 9(-0.25,0.875) 10(-0.75,0.875)
  rect 0.5x0.28 smd: 5(0.875,-0.25) 6(0.875,0.25) 11(-0.875,0.25) 12(-0.875,-0.25)
LGA-14_L3.0-W2.5-P0.50-TL
  rect 0.675x0.28 smd: 1(-1.262,0.75) 2(-1.262,0.25) 3(-1.262,-0.25) 4(-1.262,-0.75) 8(1.262,-0.75) 9(1.262,-0.25) 10(1.262,0.25) 11(1.262,0.75)
  rect 0.28x0.675 smd: 5(-0.5,-1.012) 6(0,-1.012) 7(0.5,-1.012) 12(0.5,1.012) 13(0,1.012) 14(-0.5,1.012)
R0402
  rect 0.566x0.54 smd: 1(-0.433,0) 2(0.433,0)
RF-SMD_FRF05002-JSS103M
  rect 1x1.05 smd: 1(0,-0.762)
  rect 1.05x2.2 smd: 2(-1.475,0.762) 3(1.475,0.762)
screw-hole-m2
  round 4 hole 4: 1(0,0)
SOT-23-3_L2.9-W1.6-P1.90-LS2.8-BR
  rect 1.07x0.6 smd: 1(1.235,-0.95) 2(1.235,0.95) 3(-1.235,0)
SW-SMD_4P-L5.1-W5.1-P3.70-LS6.5-TL-2
  rect 1.7x1 smd: 1(-3.3,1.85) 2(3.3,1.85) 3(-3.3,-1.85) 4(3.3,-1.85)
TQFP-48_L7.0-W7.0-P0.50-LS9.0-BL
  oval 0.28x1.8 smd: 1(-2.75,-4.05) 2(-2.25,-4.05) 3(-1.75,-4.05) 4(-1.25,-4.05) 5(-0.75,-4.05) 6(-0.25,-4.05) 7(0.25,-4.05) 8(0.75,-4.05) 9(1.25,-4.05) 10(1.75,-4.05) 11(2.25,-4.05) 12(2.75,-4.05) 25(2.75,4.05) 26(2.25,4.05) 27(1.75,4.05) 28(1.25,4.05) 29(0.75,4.05) 30(0.25,4.05) 31(-0.25,4.05) 32(-0.75,4.05) 33(-1.25,4.05) 34(-1.75,4.05) 35(-2.25,4.05) 36(-2.75,4.05)
  oval 1.8x0.28 smd: 13(4.05,-2.75) 14(4.05,-2.25) 15(4.05,-1.75) 16(4.05,-1.25) 17(4.05,-0.75) 18(4.05,-0.25) 19(4.05,0.25) 20(4.05,0.75) 21(4.05,1.25) 22(4.05,1.75) 23(4.05,2.25) 24(4.05,2.75) 37(-4.05,2.75) 38(-4.05,2.25) 39(-4.05,1.75) 40(-4.05,1.25) 41(-4.05,0.75) 42(-4.05,0.25) 43(-4.05,-0.25) 44(-4.05,-0.75) 45(-4.05,-1.25) 46(-4.05,-1.75) 47(-4.05,-2.25) 48(-4.05,-2.75)
WIRELM-SMD_18P-L16.5-W14.5_P1.80-TL
  rect 2.6x1 smd: 1(-7.25,7.2) 2(-7.25,5.4) 3(-7.25,3.6) 4(-7.25,1.8) 5(-7.25,0) 6(-7.25,-1.8) 7(-7.25,-3.6) 8(-7.25,-5.4) 9(-7.25,-7.2) 10(7.25,-7.2) 11(7.25,-5.4) 12(7.25,-3.6) 13(7.25,-1.8) 14(7.25,0) 15(7.25,1.8) 16(7.25,3.6) 17(7.25,5.4) 18(7.25,7.2)

## Nets
As in the schematic.

Pads without a net: J1 3 4 5; SCREW1 1; SCREW2 1; SCREW3 1; SCREW4 1; SW1 2 4; U2 6 7 9 11 12 14 15 16; U4 8 9 13 19 24 25 27 30 31 32 33 34 35 36 37 38 39 44 45 48; U7 10 11; U8 4 5 6 7 8 9 13 14 18; U14 2 8; U17 2 11 12

## Via types
v1: diameter 0.61, hole 0.305, Top Layer to Bottom Layer, 80 vias
v2: diameter 0.508, hole 0.3, Top Layer to Bottom Layer, 1 via

## Routing (per net, layer and track width the routed paths; a pad name or vN(x,y) marks a point on that pad's centre or on a via; arc(x,y) is an arc through that point)
GND: length 294.4
  Top Layer w0.254: GPS_VR1.1 37,6.5 U8.1 ; GPS_VR1.1 34.07,10.19 GPS_VR.1 ; GPS_VR1.1 34.07,8.37 33.12,7.41 28.7,7.41 28.19,6.91 ; 39.73,30.72 33.96,30.72 33.36,30.13 LORA_VR2.1 ; 39.73,30.72 35.77,26.76 LORA_VR.1 34.45,26.07 LORA_VR1.1 33.27,24.11 33.27,23.72 34.45,22.54 ; 39.73,30.72 49.45,30.72 ; 34.45,22.54 37.41,22.54 U2.1 ; 34.45,22.54 BAR_DC1.1 ; 25.27,14.47 MCU_DC1.2 ; 25.27,14.47 25.49,14.24 GPS_VR2.1 32.98,14.24 33.69,13.53 40.6,13.53 ; 25.27,14.47 23.88,14.47 ; 12.45,32.89 14.61,32.89 15.4,33.68 18.42,33.68 18.67,33.42 20.68,33.42 20.96,33.15 ; 12.45,32.89 12.13,33.22 MAG_VR.1 12.13,33.83 11.81,34.15 ; 12.45,32.89 12.45,32.34 ; 20.96,33.15 20.96,39.01 ; 20.96,33.15 20.96,31.97 ; 25.14,21.45 26.23,22.54 BAR_DC2.1 26.29,25.97 BAR_VR2.1 ; 25.14,21.45 25.15,21.44 25.15,20.72 27.49,20.72 27.94,21.16 U6.3 ; 25.14,21.45 IMU_DC1.1 23.71,21.02 21.92,21.02 U7.7 U7.6 21.21,20.62 18.99,20.62 IMU_DC2.1 17.85,21.75 MAG_C1.2 14.68,21.48 U17.6 12.95,21.48 U17.8 12.95,22.97 13.25,23.26 ; 40.6,13.53 U8.3 ; 40.6,13.53 47.42,13.53 51.45,17.56 51.45,17.94 ; MCU_DC6.1 v1(16.64,6.21) ; MCU_DC6.1 18.8,5.65 J1.6 ; MCU_DC6.1 17.44,7.7 ; 11.81,34.15 MAG_VR1.1 ; 11.81,34.15 11.81,39.01 ; 10.29,20.68 11.18,19.8 11.18,15.58 11.4,15.35 ; 10.29,20.68 MAG_DC1.1 ; 10.29,20.68 8.26,22.72 8.26,26.79 7.83,27.21 ; 7.83,27.21 8.33,27.71 MAG_DC2a.2 ; 7.83,27.21 U14.1 ; SW1.1 22.41,39.01 20.96,39.01 ; 24.57,7.64 24.51,7.7 23.53,7.7 ; 28.19,6.91 28.19,2.89 JP1.2 JP1.3 ; 28.19,6.91 24.32,6.91 23.53,7.7 ; 20.96,31.97 19.96,30.97 IMU_VR1.1 19.61,30.28 20.64,30.28 21.05,29.88 21.05,28.6 ; 20.96,31.97 21.16,31.77 23.26,31.77 24.18,30.84 BAR_VR1.1 27.36,30.03 BAR_VR.1 28.67,29.62 BAR_VR2.1 ; v1(45.5,39.77) 47.6,39.77 49.45,37.93 U2.10 49.45,30.72 ; v1(10.16,13.99) 10.16,15.1 MCU_DC3.2 11.4,15.35 ; 23.53,7.7 17.44,7.7 ; 17.44,7.7 MCU_DC5.1 17.16,8.68 U4.29 ; 20.96,39.01 20.19,39.01 ; 51.45,17.94 U2.8 51.45,28.72 49.45,30.72 ; 51.45,17.94 U8.10 ; v1(8.33,11.96) 8.33,11.96 MCU_VR1.1 ; U6.8 U6.9 28.67,22.86 BAR_VR2.1 ; 23.88,14.47 23.85,14.49 U4.43 20.7,14.49 18.16,11.96 17.02,11.96 16.87,12.1 16.87,15.22 16.29,15.8 14.97,15.8 14.97,15.9 14.88,15.99 U4.15 12.58,15.99 MCU_DC4.2 11.4,15.35 ; 23.88,14.47 MCU_DC2.2 ; v1(9.14,8.28) 9.14,7.61 9.08,7.55 9.49,7.14 MCU_VR2.1
  Bottom Layer w0.254: v1(16.64,6.21) 16.33,5.9 v1(9.49,5.9) ; 11.81,39.01 11.81,32.17 U14.1 ; v1(42.36,39.77) v1(45.5,39.77) ; v1(9.14,8.28) 8.33,9.09 v1(8.33,11.96) 10.16,13.8 v1(10.16,13.99)
VCC: length 106.8
  Top Layer w0.254: 22.47,32.75 26.2,32.75 26.54,32.41 ; 22.47,32.75 IMU_VR.3 ; 22.47,32.75 v1(22.47,33.04) ; v1(24,12.34) 24.51,11.83 GPS_VR.3 32.29,10.11 GPS_VR1.2 ; LORA_VR1.2 33.36,27.02 LORA_VR.3 31.56,28.82 v1(31.56,28.93) ; v1(12.07,12.09) 11.94,11.96 MCU_VR1.2 ; MAG_VR1.2 10.41,35.24 9.81,34.64 9.81,33.49 11.56,31.74 18.6,31.74 19.39,32.53 v1(19.39,32.61) ; MAG_VR.3 14.93,36.18 17.65,38.91 H3.1 ; BAR_VR.3 29.13,32.41 26.54,32.41 ; 26.54,32.41 BAR_VR1.2 ; MCU_VR.3 10.07,10.05 v1(12.19,10.05)
  Bottom Layer w0.254: 22.72,33.04 27.44,33.04 v1(31.56,28.93) ; 22.72,33.04 22.72,23.77 23.75,22.75 23.75,17.76 23.16,17.17 21.84,17.17 21.51,16.83 19.98,16.83 17.79,14.64 ; 22.72,33.04 v1(22.47,33.04) 19.75,33.04 19.32,32.61 ; H3.1 17.65,34.28 19.32,32.61 ; v1(24,12.34) 23.22,13.13 19.08,13.13 17.79,14.42 17.79,14.64 ; 17.79,14.64 15.23,12.09 v1(12.07,12.09) 12.19,11.96 v1(12.19,10.05) ; 19.32,32.61 v1(19.39,32.61)
VDD_BAR: length 24
  Top Layer w0.254: v1(30.16,29.05) BAR_VR.2 29.76,29.62 29.76,28.34 30.44,27.66 30.44,21.99 30.98,21.45 BAR_DC1.2 ; 27.31,22.82 27.87,22.82 ; 27.31,22.82 26.92,22.43 26.92,22.07 26.3,21.45 BAR_DC2.2 ; 27.31,22.82 v1(27.31,22.9) ; 27.87,22.82 U6.10 ; 27.87,22.82 U6.1
  Bottom Layer w0.254: v1(27.31,22.9) 26.04,24.17 26.04,28.34 26.75,29.05 v1(30.16,29.05)
VDD_GPS: length 30.2
  Top Layer w0.254: U8.16 36.9,14.24 GPS_VR2.2 34.07,14.25 32.43,15.9 v1(26.16,15.9) ; U8.16 U8.17 ; U8.16 U8.15 ; v1(28.96,13.1) 29.28,12.78 34.76,12.78
  Bottom Layer w0.254: v1(28.96,13.1) 28.96,13.25 26.31,15.9 v1(26.16,15.9)
VDD_IMU: length 26.8
  Top Layer w0.254: U7.5 20.71,21.73 20.44,22 U7.3 U7.2 18.2,22.5 IMU_DC2.2 17.91,22.79 17.91,24.68 20.18,24.68 20.18,24.47 21.58,24.47 22.05,24.94 22.05,28.51 IMU_VR2.2 22.14,29.88 22.54,30.28 24.13,28.69 IMU_DC1.2 23.66,22.54 23.14,22.02 23.14,21.5 U7.8
VDD_LORA: length 24.7
  Top Layer w0.254: 43.45,39.17 43.81,39.17 44.41,39.77 ; 43.45,39.17 41.58,39.17 40.98,39.76 LORA_DC2.1 ; 43.45,39.17 U2.13 43.45,37.06 39.26,32.87 35.02,32.87 32.67,30.53 32.67,29.71 33.73,28.66 34.45,28.66 ; LORA_VR.2 34.45,28.66 ; 34.45,28.66 LORA_VR2.2
VDD_MAG: length 21.5
  Top Layer w0.254: v1(16,32.53) 15.81,32.34 MAG_VR2.2 ; U17.10 10.74,22.1 MAG_DC1.2 ; U17.10 11.95,23.06 MAG_DC2.2 12.16,24.49 16.01,28.34 ; U17.10 U17.9 ; MAG_VR.2 14.63,34.31 v1(15.75,34.31) ; 16.01,28.34 16.11,28.44 v1(16.22,28.44) ; 16.01,28.34 MAG_DC2a.1
  Bottom Layer w0.254: v1(16.22,28.44) 16.22,32.32 v1(16,32.53) 15.75,32.79 v1(15.75,34.31)
VDD_MCU: length 74
  Top Layer w0.254: MCU_DC6.2 16.35,7.55 ; 16.35,7.55 MCU_DC5.2 16.66,8.71 U4.28 16.66,11.15 16.96,11.45 18.29,11.45 20.83,13.99 U4.42 23.17,13.99 23.17,13.66 23.51,13.32 MCU_DC2.1 MCU_DC1.1 ; 16.35,7.55 10.98,7.55 10.88,7.45 10.58,7.45 ; v1(12.14,17.12) 12.14,16.49 ; 12.14,16.49 U4.14 ; 12.14,16.49 11.99,16.49 MCU_DC4.1 ; 10.58,7.45 MCU_VR2.2 12.19,5.61 J1.2 ; 10.58,7.45 v1(10.14,7.45) ; MCU_DC3.1 10.41,17.29 v1(10.54,17.42)
  Bottom Layer w0.254: U15.4 14.35,32.87 7.69,26.21 6.03,26.21 5.08,25.27 5.08,19.16 6.03,18.21 9.75,18.21 v1(10.54,17.42) 10.6,17.42 ; 10.6,17.42 12.19,17.42 12.42,17.19 12.42,14.6 12.32,14.5 11.94,14.5 11.46,14.02 11.46,13.26 10.78,12.58 10.78,8.1 v1(10.14,7.45) ; 10.6,17.42 10.78,17.23
BAR_INT: length 80.4
  Top Layer w0.203: v1(21.72,31.14) 23.24,31.14 26.54,27.83 v1(27.05,27.83)
  Top Layer w0.254: U4.16 12.68,15.49 12.57,15.39 12.57,14.88 11.94,14.24 v1(10.92,14.24) ; U6.7 29.84,22.25 30.08,22.01 30.08,21.84 30.27,21.65 30.27,20.93 30.48,20.72 31.5,20.72 32,21.23 32.51,21.23 v1(33.02,20.72)
  Bottom Layer w0.203: v1(21.72,31.14) 18.16,31.14 17.14,32.15 17.14,34.95 15.75,36.34 15.75,39.77 15.37,40.15 10.92,40.15 10.54,39.77 10.54,32.41 4.7,26.56 4.7,17.42 5.97,16.15 6.62,16.15 6.72,16.25 7.01,16.25 7.04,16.28 8.89,16.28 v1(10.92,14.24) ; v1(27.05,27.83) 30.35,24.53 34.54,24.53 35.05,24.02 35.05,22.75 v1(33.02,20.72)
CS_BAR: length 26.3
  Top Layer w0.254: U4.3 19.66,15.16 v1(19.69,15.13) ; U6.6 29.72,21.56 29.72,20.59 30.1,20.21 31.88,20.21 v1(32.13,20.47) ; v1(24.64,16.66) 25.27,16.66 26.38,17.77 31.59,17.77 v1(31.75,17.93)
  Bottom Layer w0.254: v1(31.75,17.93) 32.13,18.31 v1(32.13,20.47) ; v1(19.69,15.13) 19.43,15.13 18.8,14.5 18.8,13.99 19.3,13.48 21.08,13.48 24.26,16.66 24.51,16.66
CS_DGW: length 20.2
  Top Layer w0.254: v1(23.37,6.01) 23.37,5.74 22.48,4.85 H1.1 ; U4.6 v1(18.16,12.97)
  Bottom Layer w0.254: v1(18.16,12.97) 18.67,12.47 20.19,12.47 23.37,9.29 23.37,5.99
CS_IMU: length 5.9
  Top Layer w0.203: U4.2 20.16,19.32
  Top Layer w0.254: v1(20.83,22.45) 21.03,22.45 21.22,22.64 21.59,22.64 21.71,22.76 U7.12
  Bottom Layer w0.254: 20.83,22.37 20.83,20.01 v2(20.14,19.32)
CS_LORA: length 65.9
  Top Layer w0.254: v1(20.95,18.31) 20.94,18.29 U4.1 ; v1(21.46,25.55) 21.46,25.86 v1(19.63,27.69) ; v1(42.2,20.44) 43.83,20.44 45.45,22.06 U2.5 ; v1(16.51,34.31) 19.73,34.31 v1(19.91,34.49)
  Bottom Layer w0.254: v1(19.63,27.69) 16.76,30.56 16.76,34.06 v1(16.51,34.31) ; v1(21.46,25.55) 21.46,24.05 20.8,23.39 20.57,23.39 19.94,22.75 19.94,21.74 20.07,21.61 20.07,20.21 19.43,19.58 19.43,18.44 19.69,18.18 20.83,18.18 v1(20.95,18.31) ; v1(42.2,20.44) 42.2,30.86 35.14,37.91 23.33,37.91 v1(19.91,34.49)
CS_MAG: length 8.7
  Top Layer w0.254: U17.3 12.95,20.35 v1(12.95,19.58) ; U4.7 17.66,19.45 v1(16.76,20.34)
  Bottom Layer w0.254: v1(16.76,20.34) 16.13,20.98 12.95,20.98 v1(12.95,19.58)
ESC_CURRENT: length 19.1
  Top Layer w0.254: U4.26 15.66,8.91 6.68,8.91 v1(5.83,8.05)
  Bottom Layer w0.254: v1(5.83,8.05) 5.83,14.18 U14.7
IMU_INT1: length 10.5
  Top Layer w0.254: v1(16.13,15.13) 15.15,15.13 15.01,14.99 U4.17 ; U7.4 19.49,21.5 v1(19.41,21.41)
  Bottom Layer w0.254: v1(19.41,21.41) 19.41,20.82 16.13,17.55 v1(16.13,15.13)
IMU_INT2: length 17.3
  Top Layer w0.254: U7.9 21.71,22 21.59,22.12 ; v1(15.67,14.48) 13.87,14.48 U4.18
  Bottom Layer w0.254: 21.59,22.12 21.59,18.12 21.02,17.55 19.3,17.55 18.03,18.82 16.51,17.29 16.51,15.77 16.95,15.33 16.95,14.81 16.62,14.48 v1(15.67,14.48)
  vias: v1(21.59,22.04)
MCU_RX: length 34.6
  Top Layer w0.254: U8.11 49.6,18.37 48.26,19.71 36.48,19.71 35.34,18.56 32,18.56 31.75,18.82 26.8,18.82 26.54,19.07 25.78,19.07 25.34,19.51 25.13,19.51 24.73,19.91 18.66,19.91 U4.5
MCU_TX: length 56.4
  Top Layer w0.254: U4.4 19.08,18.21 19.08,14.6 v1(19.43,14.24) ; v1(24.64,17.55) 25.4,17.55 v1(26.16,18.31)
  Bottom Layer w0.254: v1(19.43,14.24) 21.34,14.24 v1(24.64,17.55) ; 25.91,18.31 25.91,20.85 27.56,20.85 28.07,21.36 28.07,22.25 28.45,22.63 30.86,22.63 30.86,9.74 32.96,7.64 33.27,7.64 33.4,7.77 37.63,7.77 v1(47.8,17.94)
MISO: length 60.7
  Top Layer w0.254: U4.11 15.61,18.34 15.61,20.1 16.61,21.1 v1(17.14,21.1) 17.99,20.26 27.89,20.26 v1(27.94,20.21) ; U17.7 13.77,22.1 v1(13.97,22.31) ; v1(19.3,23.52) 19.43,23.52 U7.1 ; U2.2 39.45,22.06 37.89,20.5 36.1,20.5 35.43,19.83 v1(29.59,19.83) 29.2,20.22 U6.5
  Bottom Layer w0.254: 17.08,22.31 v1(13.97,22.31) ; 17.08,22.31 17.08,23.83 18.13,24.88 18.74,24.88 19.3,24.32 v1(19.3,23.52) ; 17.08,22.31 17.14,22.24 v1(17.14,21.1) ; H1.2 29.59,6.12 v1(29.59,19.83) 28.32,19.83 v1(27.94,20.21)
MOSI: length 103.2
  Top Layer w0.254: v1(16.26,19.71) 16.16,19.61 U4.10 ; U7.14 20.71,23.62 20.21,24.12 18.64,24.12 v1(18.54,24.02) ; U17.4 13.7,20.35 v1(13.91,20.14) ; v1(27.79,0.77) 27.35,0.77 26.35,1.76 26.35,2.62 24.95,4.02 v1(23.99,4.02) ; U2.3 41.45,22.06 39.53,20.14 36.38,20.14 35.18,18.94 32.39,18.94 32.13,19.2 28.83,19.2 28.83,20.58 28.75,20.65 28.75,21.12 U6.4 28.7,21.85 v1(28.84,21.99) ; v1(11.43,10.69) 11.18,10.94 7.67,10.94 4.87,8.14 4.87,4.29 H2.1
  Bottom Layer w0.254: v1(16.26,19.71) 15.82,20.14 v1(13.91,20.14) ; v1(16.26,19.71) 17.1,19.71 18.08,20.69 18.08,23.56 v1(18.54,24.02) ; v1(16.26,19.71) 13.97,17.42 13.97,14.17 12.79,12.99 11.93,12.99 11.43,12.5 v1(11.43,10.69) 11.43,9.67 11.94,9.16 19.08,9.16 23.99,4.25 v1(23.99,4.02) ; v1(28.84,21.99) 30.48,21.99 30.48,3.45 v1(27.79,0.77)
MOTOR_1: length 14.1
  Top Layer w0.254: v1(12.19,13.61) 12.31,13.49 U4.20
  Bottom Layer w0.254: v1(12.19,13.61) 12.78,14.19 12.78,17.52 7.09,23.21 U14.3
MOTOR_2: length 13.3
  Top Layer w0.254: U4.21 10.16,12.99 9.51,13.64 9.51,18.56 U14.4
MOTOR_3: length 44.4
  Top Layer w0.254: U14.5 5.83,20.24 5.83,28.02 8.08,30.26 16.23,30.26 18.48,28.01 18.48,27.38 v1(20.7,25.17) ; v1(15.24,12.97) 15.24,12.92 14.81,12.49 U4.22
  Bottom Layer w0.254: v1(15.24,12.97) 14.48,13.74 14.48,16.78 15.49,17.8 15.85,17.8 18.44,20.39 18.44,21.82 20.7,24.09 v1(20.7,25.17)
MOTOR_4: length 14.3
  Top Layer w0.254: U4.23 12.64,11.99 12.64,11.36 6.88,11.36 5.83,12.41 5.83,16.18 U14.6
RST: length 5.6
  Top Layer w0.254: U4.40 23.09,12.99 23.37,12.72 23.37,11.79 23.78,11.37 24.51,11.37 25.71,10.17 RST_RES.2
SCK: length 90.1
  Top Layer w0.254: v1(23.46,25.76) 23.46,25.24 22.33,24.12 21.21,24.12 U7.13 ; v1(27.36,21.54) 27.56,21.75 U6.2 ; v1(34.16,23.77) 34.47,24.07 42.3,24.07 43.45,22.93 U2.4 ; U17.1 11.95,18.68 12.33,18.29 U4.12 15.16,16.61 v1(15.24,16.53) ; v1(23.11,18.88) 24.45,18.88 v1(24.51,18.82)
  Bottom Layer w0.254: v1(24.51,18.82) 24.51,20.55 25.5,21.54 ; 25.5,21.54 25.5,23.72 v1(23.46,25.76) ; 25.5,21.54 25.5,2.88 10.16,2.88 H2.2 ; 25.5,21.54 v1(27.36,21.54) 27.36,22.05 29.08,23.77 v1(34.16,23.77) ; v1(15.24,16.53) 15.01,16.3 15.01,13.79 16.43,13.79 19.83,17.19 21.36,17.19 21.72,17.55 22.36,17.55 23.11,18.3 v1(23.11,18.88)
SCL: length 36.7
  Top Layer w0.254: v1(22.24,18.26) 22.29,18.26 23.17,17.38 23.17,16.49 U4.47 ; v1(14.94,37.24) 14.02,37.24 13.19,38.06 13.19,40.16 10.67,40.16 10.64,40.13 10.39,40.13 U15.2
  Bottom Layer w0.254: v1(14.94,37.24) 14.94,28.68 16.95,26.67 21.58,26.67 22.24,26.01 v1(22.24,18.26)
SDA: length 71
  Top Layer w0.254: U15.1 6.73,34.76 v1(2.95,30.98) ; U4.46 23.02,15.99 23.75,15.26 v1(24.26,15.26)
  Bottom Layer w0.254: v1(2.95,30.98) 2.4,30.43 2.4,18.03 5.19,15.25 5.19,7.65 7.54,5.29 22.26,5.29 23.25,4.3 23.25,3.31 24.73,3.31 24.73,14.79 v1(24.26,15.26)
UPDI: length 21.8
  Top Layer w0.254: J1.1 13.72,2.56 13.97,2.81 19.81,2.81 22.61,5.61 v1(22.61,6.5) ; U4.41 20.84,13.49 20.7,13.36 20.7,12.72 v1(19.81,11.83)
  Bottom Layer w0.254: v1(22.61,6.5) 19.81,9.29 v1(19.81,11.83)
$1N5000: length 46.9
  Top Layer w0.254: 25.97,7.77 32.43,7.77 v1(33.18,8.52) ; 25.97,7.77 24.84,8.9 RST_RES.1 ; 25.97,7.77 C27.2 ; SW1.3 27.21,35.76 31.67,31.3 v1(32.12,31.3)
  Bottom Layer w0.254: v1(32.12,31.3) 35.78,27.64 35.78,11.12 v1(33.18,8.52)
$1N10503: length 1.5
  Top Layer w0.254: MAG_C1.1 14.64,20.98 U17.5
$1N13814: length 5.7
  Top Layer w0.254: U8.2 38.8,0.93 38.77,0.91 ANT_C.2
$1N16458: length 5.3
  Top Layer w0.254: ANT_C.1 JP1.1

## Text on the board
Top Silkscreen Layer: Designed | By | Nathan | Dablain | VCC | GND
